# EAGLE design untitled (EAGLE 7.5.0)
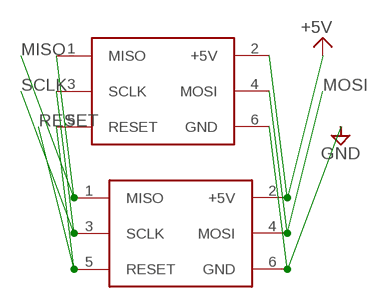
[diagram p0: schematic, sheet 1]

## Parts
U$1  ICSP  [ICSP]
U$4  ICSP_SPRING  [ICSP_SPRING]

## Nets
+5V: U$1.2(+5V) U$4.2(+5V)
GND: U$1.6(GND) U$4.6(GND)
MISO: U$1.1(MISO) U$4.1(MISO)
MOSI: U$1.4(MOSI) U$4.4(MOSI)
RESET: U$1.5(RESET) U$4.5(RESET)
SCLK: U$1.3(SCLK) U$4.3(SCLK)

## Library data of the parts
U$1 = 08_CONECTOR:ICSP
U$4 = 08_CONECTOR:ICSP_SPRING

## Board
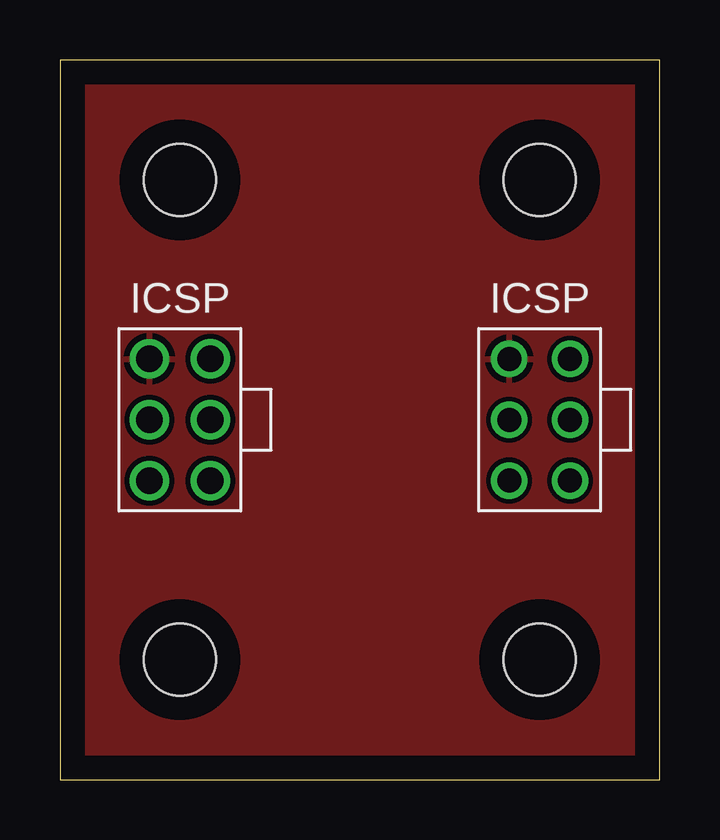
[diagram p1: board, top side]
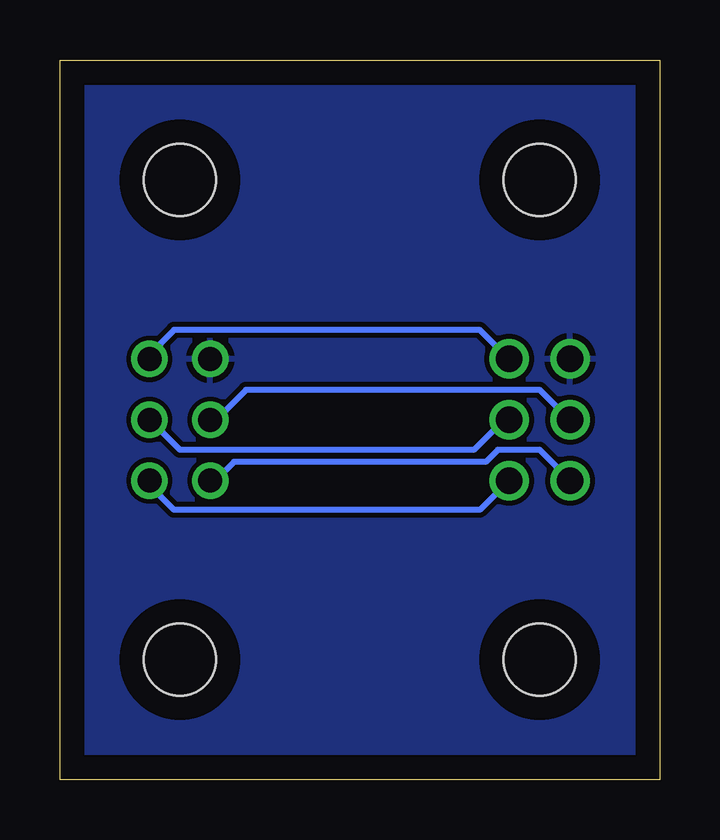
[diagram p2: board, bottom side, seen from below]

Size 25 x 30 mm. Coordinates in mm from the lower left corner, seen from the top.
Outline: 0,0 25,0 25,30 0,30 0,0
Copper layers (1*16): Top 0.035mm / dielectric 1.5mm / Bottom 0.035mm
Design rules "default": minimum track width 10mil, minimum drill 24mil, track to track 8mil, track to pad 8mil, pad to pad 8mil, via to via 8mil, smd to smd 8mil, copper to edge 40mil, drill to drill 8mil, minimum pad ring 10mil, minimum via ring 8mil, stop-mask expansion 4mil, vias tented up to drill 0mil, thermal gap 10mil
Holes 3 mm at 5,25 5,5 20,25 20,5

### Footprints (pad centres in the part's own frame; a part is rotated, then mirrored left to right if it is on the bottom)
ICSP = drill 1 pad 1.5: 1 -1.27,2.54; 2 1.27,2.54; 3 -1.27,0; 4 1.27,0; 5 -1.27,-2.54; 6 1.27,-2.54
ICSP_SPRING = drill 1.1 pad 1.5: 1 -1.27,2.54; 2 1.27,2.54; 3 -1.27,0; 4 1.27,0; 5 -1.27,-2.54; 6 1.27,-2.54

### Placement (x,y rotation side)
U$1  20,15 180 top
U$4  5,15 180 top

### Tracks (layer width: path | path; a pad name or v marks a point on that pad's centre or on a via)
+5V
  Bottom 0.254: U$1.2 18.5,12.5 17.75,13.25 7.25,13.25 6.75,13.75 5,13.75 3.75,12.5 U$4.2
GND
  pour Bottom: 0,30 25,30 25,0 0,0
  pour Top: 0,30 25,30 25,0 0,0
MISO
  Bottom 0.254: U$1.1 21.25,12.25 20.25,11.25 7.5,11.25 6.5,12.25 U$4.1
MOSI
  Bottom 0.254: U$1.4 18.5,15 17.25,16.25 5,16.25 3.75,15 U$4.4
RESET
  Bottom 0.254: U$1.5 21.25,17.75 20.25,18.75 7.5,18.75 6.5,17.75 U$4.5
SCLK
  Bottom 0.254: U$1.3 21.25,15 20,13.75 7.75,13.75 6.5,15 U$4.3